# EAGLE schematic uhf.real.control.v2 (EAGLE 6.3)
Assembly variants: Reichelt
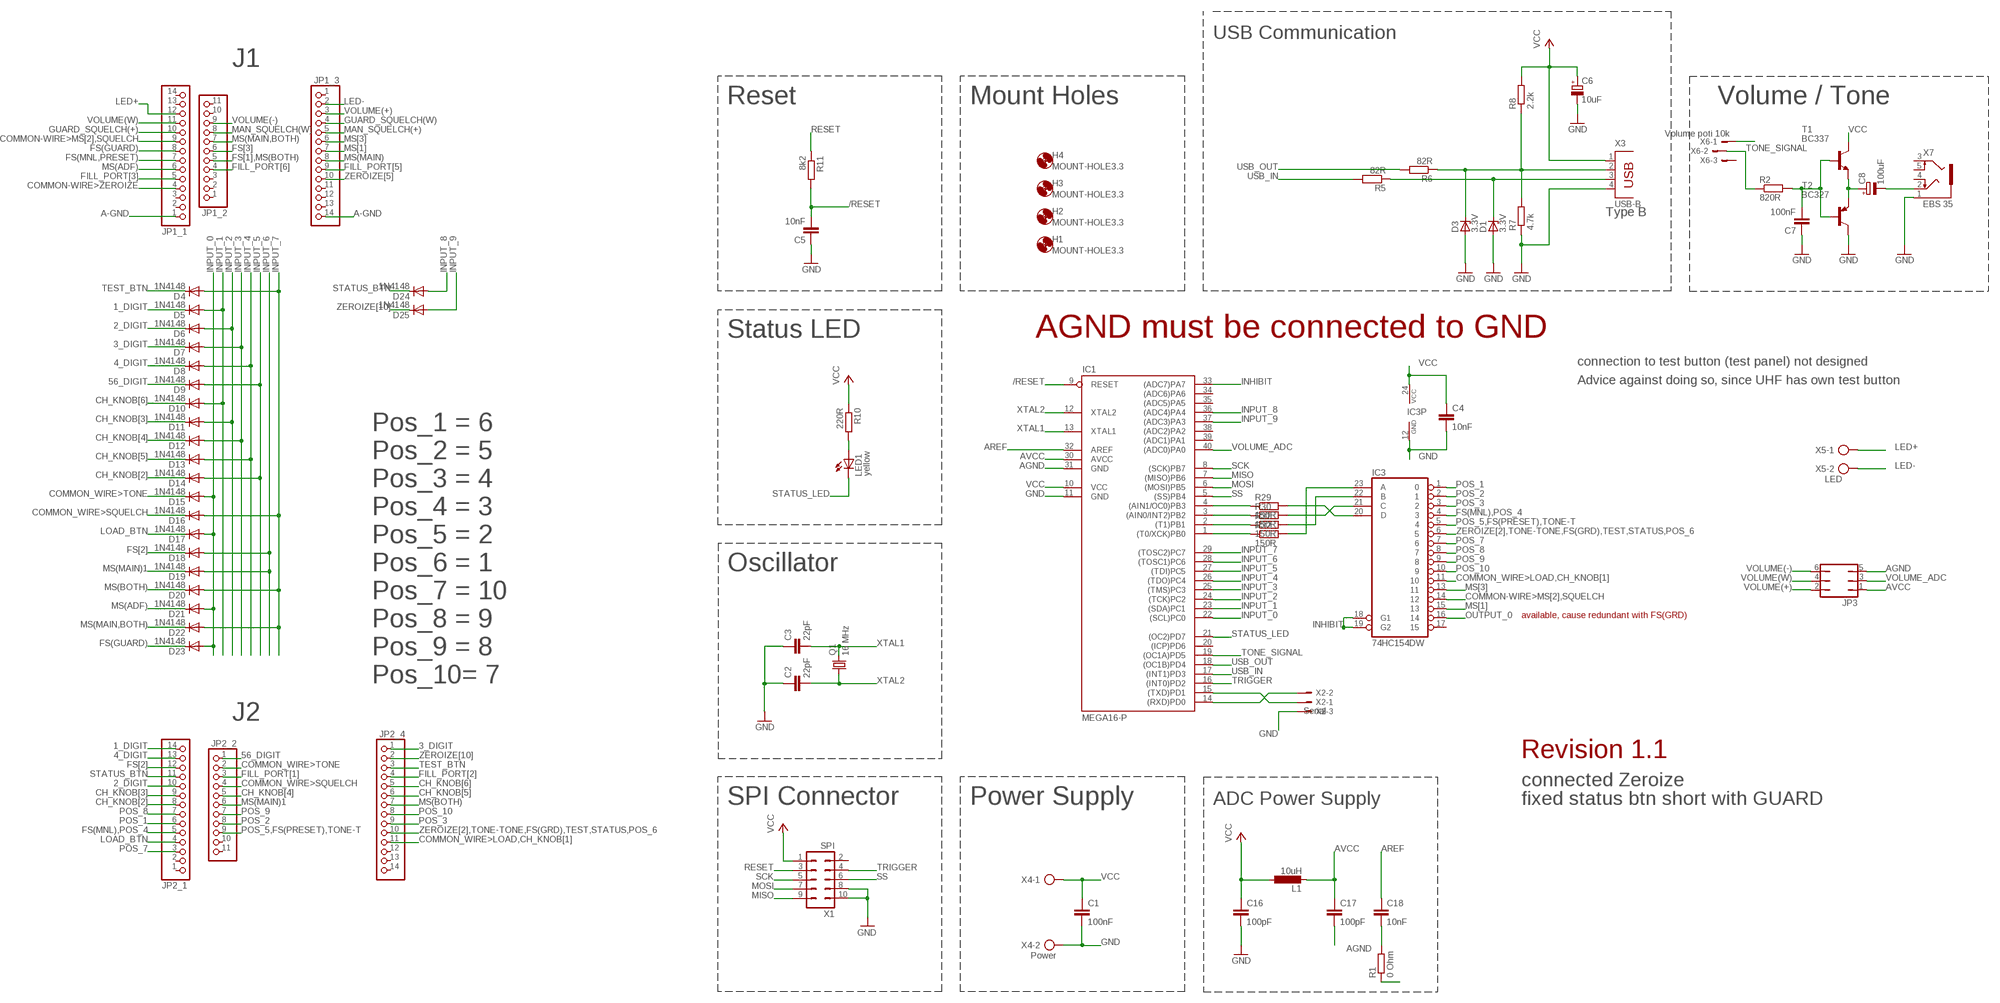
[diagram p0: schematic, sheet 1]

## Parts
C1  100nF  C-EU050-024X044  [C050-024X044]  (variant Reichelt: KERKO 100N)
C2  22pF  C-EU025-025X050  [C025-025X050]  (variant Reichelt: KERKO-500 22P)
C3  22pF  C-EU025-025X050  [C025-025X050]  (variant Reichelt: KERKO-500 22P)
C4  10nF  C-EU025-025X050  [C025-025X050]  (variant Reichelt: KERKO-500 10N)
C5  10nF  C-EU025-025X050  [C025-025X050]  (variant Reichelt: KERKO-500 10N)
C6  10uF  CPOL-EUE2.5-6  [E2,5-6]  (variant Reichelt: RAD 10/100)
C7  100nF  C-EU050-024X044  [C050-024X044]  (variant Reichelt: KERKO 100N)
C8  100uF  CPOL-EUE2.5-6  [E2,5-6]  (variant Reichelt: RAD 100/25)
C16  100pF  C-EU025-025X050  [C025-025X050]  (variant Reichelt: KERKO-500 100P)
C17  100pF  C-EU025-025X050  [C025-025X050]  (variant Reichelt: KERKO-500 100P)
C18  10nF  C-EU025-025X050  [C025-025X050]  (variant Reichelt: KERKO-500 10N)
D1  3.3V  ZENER-DIODEDO35Z10  [DO35Z10]  (variant Reichelt: ZF 3,3)
D3  3.3V  ZENER-DIODEDO35Z10  [DO35Z10]  (variant Reichelt: ZF 3,3)
D4  1N4148  DIODE-MINIMELF  [MINIMELF]  (variant Reichelt: 1N 4148 SMD)
D5  1N4148  DIODE-MINIMELF  [MINIMELF]  (variant Reichelt: 1N 4148 SMD)
D6  1N4148  DIODE-MINIMELF  [MINIMELF]  (variant Reichelt: 1N 4148 SMD)
D7  1N4148  DIODE-MINIMELF  [MINIMELF]  (variant Reichelt: 1N 4148 SMD)
D8  1N4148  DIODE-MINIMELF  [MINIMELF]  (variant Reichelt: 1N 4148 SMD)
D9  1N4148  DIODE-MINIMELF  [MINIMELF]  (variant Reichelt: 1N 4148 SMD)
D10  1N4148  DIODE-MINIMELF  [MINIMELF]  (variant Reichelt: 1N 4148 SMD)
D11  1N4148  DIODE-MINIMELF  [MINIMELF]  (variant Reichelt: 1N 4148 SMD)
D12  1N4148  DIODE-MINIMELF  [MINIMELF]  (variant Reichelt: 1N 4148 SMD)
D13  1N4148  DIODE-MINIMELF  [MINIMELF]  (variant Reichelt: 1N 4148 SMD)
D14  1N4148  DIODE-MINIMELF  [MINIMELF]  (variant Reichelt: 1N 4148 SMD)
D15  1N4148  DIODE-MINIMELF  [MINIMELF]  (variant Reichelt: 1N 4148 SMD)
D16  1N4148  DIODE-MINIMELF  [MINIMELF]  (variant Reichelt: 1N 4148 SMD)
D17  1N4148  DIODE-MINIMELF  [MINIMELF]  (variant Reichelt: 1N 4148 SMD)
D18  1N4148  DIODE-MINIMELF  [MINIMELF]  (variant Reichelt: 1N 4148 SMD)
D19  1N4148  DIODE-MINIMELF  [MINIMELF]  (variant Reichelt: 1N 4148 SMD)
D20  1N4148  DIODE-MINIMELF  [MINIMELF]  (variant Reichelt: 1N 4148 SMD)
D21  1N4148  DIODE-MINIMELF  [MINIMELF]  (variant Reichelt: 1N 4148 SMD)
D22  1N4148  DIODE-MINIMELF  [MINIMELF]  (variant Reichelt: 1N 4148 SMD)
D23  1N4148  DIODE-MINIMELF  [MINIMELF]  (variant Reichelt: 1N 4148 SMD)
D24  1N4148  DIODE-MINIMELF  [MINIMELF]  (variant Reichelt: 1N 4148 SMD)
D25  1N4148  DIODE-MINIMELF  [MINIMELF]  (variant Reichelt: 1N 4148 SMD)
H1  MOUNT-HOLE3.3  [3,3]
H2  MOUNT-HOLE3.3  [3,3]
H3  MOUNT-HOLE3.3  [3,3]
H4  MOUNT-HOLE3.3  [3,3]
IC1  MEGA16-P  [DIL40]
IC3  74HC154DW  [SO24W]
JP1_1  PINHD-1X14  [1X14]  (variant Reichelt: BL 1X20G 2,54)
JP1_2  PINHD-1X11  [1X11]  (variant Reichelt: BL 1X20G 2,54)
JP1_3  PINHD-1X14  [1X14]  (variant Reichelt: BL 1X20G 2,54)
JP2_1  PINHD-1X14  [1X14]  (variant Reichelt: BL 1X20G 2,54)
JP2_2  PINHD-1X11  [1X11]  (variant Reichelt: BL 1X20G 2,54)
JP2_4  PINHD-1X14  [1X14]  (variant Reichelt: BL 1X20G 2,54)
JP3  JP3Q  [JP3Q]  (variant Reichelt: MPE 087-2-006)
L1  10uH  L-EU2200-15.24  [2200-15.24]  (variant Reichelt: SMCC 10u)
LED1  yellow  LEDCHIPLED_1206  [CHIPLED_1206]  (variant Reichelt: SMD-LED 1206 GE)
Q1  16 MHz  CRYSTALHC18U-V  [HC18U-V]  (variant Reichelt: 16,0000-HC49U-S)
R1  0 Ohm  R-EU_R0805  [R0805]
R2  820R  R-EU_0207/12  [0207/12]  (variant Reichelt: METALL 820)
R5  82R  R-EU_R0805  [R0805]  (variant Reichelt: SMD-0805 82,0)
R6  82R  R-EU_R0805  [R0805]  (variant Reichelt: SMD-0805 82,0)
R7  4.7k  R-EU_R0805  [R0805]  (variant Reichelt: SMD-0805 4,70k)
R8  2.2k  R-EU_R0805  [R0805]  (variant Reichelt: SMD-0805 2,20k)
R10  220R  R-EU_R0805  [R0805]  (variant Reichelt: SMD-0805 220)
R11  8k2  R-EU_M0805  [M0805]  (variant Reichelt: SMD-0805 8,20k)
R29  150R  R-EU_M0805  [M0805]  (variant Reichelt: SMD-0805 150)
R30  150R  R-EU_M0805  [M0805]  (variant Reichelt: SMD-0805 150)
R31  150R  R-EU_M0805  [M0805]  (variant Reichelt: SMD-0805 150)
R32  150R  R-EU_M0805  [M0805]  (variant Reichelt: SMD-0805 150)
T1  BC337  BC337-25-NPN-TO92-EBC  [TO92-EBC]  (variant Reichelt: BC 337-25)
T2  BC327  BC327-25-PNP-TO92-EBC  [TO92-EBC]  (variant Reichelt: BC 327-25)
X1  SPI  ML10  [ML10]  (variant Reichelt: WSL 10G)
X2  Serial  22-23-2031  [22-23-2031]
X3  USB-B  PN61729  [PN61729]  (variant Reichelt: USB BW)
X4  Power  AK500/2  [AK500/2]  (variant Reichelt: AKL 101-03)
X5  LED  AK500/2  [AK500/2]  (variant Reichelt: AKL 101-02)
X6  Volume poti 10k  22-23-2031  [22-23-2031]
X7  EBS 35  1503_09  [1503_09]

## Nets
1_DIGIT: D5.C JP2_1.14
2_DIGIT: D6.C JP2_1.10
3_DIGIT: D7.C JP2_4.1
4_DIGIT: D8.C JP2_1.13
56_DIGIT: D9.C JP2_2.1
/RESET: C5.2 IC1.9(RESET) R11.2
A-GND: JP1_1.1 JP1_3.14
AGND: C17.2 C18.2 IC1.31(GND) JP3.5 R1.2
AREF: C18.1 IC1.32(AREF)
AVCC: C17.1 IC1.30(AVCC) JP3.1 L1.2
CH_KNOB[2]: D14.C JP2_1.8
CH_KNOB[3]: D11.C JP2_1.9
CH_KNOB[4]: D12.C JP2_2.5
CH_KNOB[5]: D13.C JP2_4.6
CH_KNOB[6]: D10.C JP2_4.5
COMMON-WIRE>MS[2],SQUELCH: IC3.14 JP1_1.9
COMMON-WIRE>ZEROIZE: JP1_1.4
COMMON_WIRE>LOAD,CH_KNOB[1]: IC3.11 JP2_4.11
COMMON_WIRE>SQUELCH: D16.C JP2_2.4
COMMON_WIRE>TONE: D15.C JP2_2.2
FILL_PORT[1]: JP2_2.3
FILL_PORT[2]: JP2_4.4
FILL_PORT[3]: JP1_1.5
FILL_PORT[5]: JP1_3.9
FILL_PORT[6]: JP1_2.4
FS(GUARD): D23.C JP1_1.8
FS(MNL),POS_4: IC3.4 JP2_1.5
FS(MNL,PRESET): JP1_1.7
FS[1],MS(BOTH): JP1_2.5
FS[2]: D18.C JP2_1.12
FS[3]: JP1_2.6
GND: C1.2 C2.1 C3.1 C4.2 C5.1 C6.- C7.1 C16.2 D1.A D3.A IC1.11(GND) IC3.12(GND) R1.1 R7.1 T2.C X1.8 X1.10 X2.3 X3.4 X4.2 X7.1
GUARD_SQUELCH(+): JP1_1.10
GUARD_SQUELCH(W): JP1_3.4
IN: D1.C R5.1 X3.3
INHIBIT: IC1.33((ADC7)PA7) IC3.18(G1) IC3.19(G2)
INPUT_0: D15.A D17.A D21.A D23.A IC1.22((SCL)PC0)
INPUT_1: D5.A D10.A IC1.23((SDA)PC1)
INPUT_2: D6.A D11.A IC1.24((TCK)PC2)
INPUT_3: D7.A D12.A IC1.25((TMS)PC3)
INPUT_4: D8.A D13.A IC1.26((TDO)PC4)
INPUT_5: D9.A D14.A IC1.27((TDI)PC5)
INPUT_6: D18.A D19.A IC1.28((TOSC1)PC6)
INPUT_7: D4.A D16.A D20.A D22.A IC1.29((TOSC2)PC7)
INPUT_8: D24.A IC1.36((ADC4)PA4)
INPUT_9: D25.A IC1.37((ADC3)PA3)
LED+: JP1_1.12 X5.1
LED-: JP1_3.2 X5.2
LOAD_BTN: D17.C JP2_1.4
MAN_SQUELCH(+): JP1_3.5
MAN_SQUELCH(W): JP1_2.8
MISO: IC1.7((MISO)PB6) X1.9
MOSI: IC1.6((MOSI)PB5) X1.7
MS(ADF): D21.C JP1_1.6
MS(BOTH): D20.C JP2_4.7
MS(MAIN): JP1_3.8
MS(MAIN)1: D19.C JP2_2.6
MS(MAIN,BOTH): D22.C JP1_2.7
MS[1]: IC3.15 JP1_3.7
MS[3]: IC3.13 JP1_3.6
N$1: IC3.23(A) R32.2
N$2: C7.2 R2.2 T1.B T2.B
N$3: IC3.22(B) R31.2
N$4: IC3.21(C) R30.2
N$5: C8.+ T1.E T2.E
N$6: C8.- X7.2
N$7: IC3.20(D) R29.2
N$8: IC1.4((AIN1/OC0)PB3) R29.1
N$9: IC1.3((AIN0/INT2)PB2) R30.1
N$10: IC1.2((T1)PB1) R31.1
N$11: IC1.1((T0/XCK)PB0) R32.1
N$17: R2.1 X6.2
N$47: LED1.A R10.2
OUT: D3.C R6.1 R7.2 R8.1 X3.2
OUTPUT_0: IC3.16
POS_1: IC3.1 JP2_1.6
POS_2: IC3.2 JP2_2.8
POS_3: IC3.3 JP2_4.9
POS_5,FS(PRESET),TONE-T: IC3.5 JP2_2.9
POS_7: IC3.7 JP2_1.3
POS_8: IC3.8 JP2_1.7
POS_9: IC3.9 JP2_2.7
POS_10: IC3.10 JP2_4.8
RESET: R11.1 X1.3
RX: IC1.14((RXD)PD0) X2.2
SCK: IC1.8((SCK)PB7) X1.5
SS: IC1.5((SS)PB4) X1.6
STATUS_BTN: D24.C JP2_1.11
STATUS_LED: IC1.21((OC2)PD7) LED1.C
TEST_BTN: D4.C JP2_4.3
TONE_SIGNAL: IC1.19((OC1A)PD5) X6.1
TRIGGER: IC1.16((INT0)PD2) X1.4
TX: IC1.15((TXD)PD1) X2.1
USB_IN: IC1.17((INT1)PD3) R5.2
USB_OUT: IC1.18((OC1B)PD4) R6.2
VCC: C1.1 C4.1 C6.+ C16.1 IC1.10(VCC) IC3.24(VCC) L1.1 R8.2 R10.1 T1.C X1.1 X3.1 X4.1
VOLUME(+): JP1_3.3 JP3.2
VOLUME(-): JP1_2.9 JP3.6
VOLUME(W): JP1_1.11 JP3.4
VOLUME_ADC: IC1.40((ADC0)PA0) JP3.3
XTAL1: C3.2 IC1.13(XTAL1) Q1.2
XTAL2: C2.2 IC1.12(XTAL2) Q1.1
ZEROIZE[2],TONE-TONE,FS(GRD),TEST,STATUS,POS_6: IC3.6 JP2_4.10
ZEROIZE[5]: JP1_3.10
ZEROIZE[10]: D25.C JP2_4.2
Unconnected: IC1.20((ICP)PD6) IC1.34((ADC6)PA6) IC1.35((ADC5)PA5) IC1.38((ADC2)PA2) IC1.39((ADC1)PA1) IC3.17 JP1_1.2 JP1_1.3 JP1_1.13 JP1_1.14 JP1_2.1 JP1_2.2 JP1_2.3 JP1_2.10 JP1_2.11 JP1_3.1 JP1_3.11 JP1_3.12 JP1_3.13 JP2_1.1 JP2_1.2 JP2_2.10 JP2_2.11 JP2_4.12 JP2_4.13 JP2_4.14 X1.2 X6.3 X7.3 X7.4 X7.5

## Notes on the sheet
- USB Communication
- J1
- Reset | Mount Holes | Volume / Tone
- Type B
- Status LED | AGND must be connected to GND
- connection to test button (test panel) not designed
- Advice against doing so, since UHF has own test button
- Pos_1 = 6
- Pos_2 = 5
- Pos_3 = 4
- Pos_4 = 3
- Pos_5 = 2
- Pos_6 = 1 | Oscillator
- Pos_7 = 10
- available, cause redundant with FS(GRD)
- Pos_8 = 9
- Pos_9 = 8
- Pos_10= 7
- J2
- Revision 1.1
- connected Zeroize
- SPI Connector | Power Supply | ADC Power Supply | fixed status btn short with GUARD

## Library data of the parts
C1-C5 C7 C16-C18 = rcl:C-EU: CAPACITOR, European symbol
C6 C8 = rcl:CPOL-EU: POLARIZED CAPACITOR, European symbol
D1 D3 = diode:ZENER-DIODE: Z-Diode
D4-D25 = diode:DIODE-: DIODE
H1-H4 = holes:MOUNT-HOLE: MOUNTING HOLE with drill center marker
IC1 = atmel:MEGA16-P: MICROCONTROLLER 16 Kbytes FLASH 1 kbytes SRAM 512 bytes EEPROM USART 8-channel 10 bit ADC Source: avr.lbr
IC3 = 74xx-eu:74*154: 4-line to 16-line data SELECTOR/MULTIPLEXER
JP1_1 JP1_3 JP2_1 JP2_4 = pinhead:PINHD-1X14: PIN HEADER
JP1_2 JP2_2 = pinhead:PINHD-1X11: PIN HEADER
JP3 = jumper:JP3Q: JUMPER
L1 = rcl:L-EU: INDUCTOR, European symbol
LED1 = led:LED: LED OSRAM: - CHIPLED LG R971, LG N971, LY N971, LG Q971, LY Q971, LO R971, LY R971 LH N974, LH R974 LS Q976, LO Q976, LY Q976 LO Q996 - Hyper CHIPLED LW Q18S LB Q993, LB Q99A, LB R99A - SideLED LS A670, LO A670, LY A670, LG A670, LP A670 LB A673, LV A673, LT A673, LW A673 LH A674 LY A675 LS A676, LA A676, LO A676, LY A676, LW A676 LS A679, LY A679, LG A679 - Hyper Micro SIDELED® LS Y876, LA Y876, LO Y876, LY Y876 LT Y87S - SmartLED LW L88C, LW L88S LB L89C, LB L89S, LG L890 LS L89K, LO L89K, LY L89K LS L896, LA L896, LO L896, LY L896 - TOPLED LS T670, LO T670, LY T670, LG T670, LP T670 LSG T670, LSP T670, LSY T670, LOP T670, LYG T670 LG T671, LOG T671, LSG T671 LB T673, LV T673, LT T673, LW T673 LH T674 LS T676, LA T676, LO T676, LY T676, LB T676, LH T676, LSB T676, LW T676 LB T67C, LV T67C, LT T67C, LS T67K, LO T67K, LY T67K, LW E67C LS E67B, LA E67B, LO E67B, LY E67B, LB E67C, LV E67C, LT E67C LW T67C LS T679, LY T679, LG T679 LS T770, LO T770, LY T770, LG T770, LP T770 LB T773, LV T773, LT T773, LW T773 LH T774 LS E675, LA E675, LY E675, LS T675 LS T776, LA T776, LO T776, LY T776, LB T776 LHGB T686 LT T68C, LB T68C - Hyper Mini TOPLED® LB M676 - Mini TOPLED Santana® LG M470 LS M47K, LO M47K, LY M47K Source: http://www.osram.convergy.de - LUMILED® LXK2-PW12-R00, LXK2-PW12-S00, LXK2-PW14-U00, LXK2-PW14-V00 LXK2-PM12-R00, LXK2-PM12-S00, LXK2-PM14-U00 LXK2-PE12-Q00, LXK2-PE12-R00, LXK2-PE12-S00, LXK2-PE14-T00, LXK2-PE14-U00 LXK2-PB12-K00, LXK2-PB12-L00, LXK2-PB12-M00, LXK2-PB14-N00, LXK2-PB14-P00, LXK2-PB14-Q00 LXK2-PR12-L00, LXK2-PR12-M00, LXK2-PR14-Q00, LXK2-PR14-R00 LXK2-PD12-Q00, LXK2-PD12-R00, LXK2-PD12-S00 LXK2-PH12-R00, LXK2-PH12-S00 LXK2-PL12-P00, LXK2-PL12-Q00, LXK2-PL12-R00 Source: www.luxeon.com
Q1 = crystal:CRYSTAL: CRYSTAL
R1 R2 R5-R8 R10 R11 R29-R32 = rcl:R-EU_: RESISTOR, European symbol
T1 = transistor:*-NPN-: NPN Transistror BF959 corrected 2008.03.06
T2 = transistor:*-PNP-: PNP Transistror
X1 = con-harting-ml:ML10: HARTING
X2 X6 = con-molex:22-23-2031: .100" (2.54mm) Center Header - 3 Pin; MF: MOLEX; MPN: 22-23-2031; OC_FARNELL: 1462950; OC_NEWARK: 30C0862
X3 = con-berg:PN61729: BERG USB connector
X4 X5 = con-ptr500:AK500/2: CONNECTOR
X7 = con-lumberg:1503_09: Jack connectors according to JISC 6560, 3.5 mm Klinkeneinbaukupplung nach JISC 6560, 3,5 mm, 3-polig/ stereo, abgewinkelte Ausführung, mit 2 Öffnern und Lötaugen, für Leiterplatten Rückseitenmontage Source: http://www.lumberg.com/Produkte/PDFs/1503_09.pdf